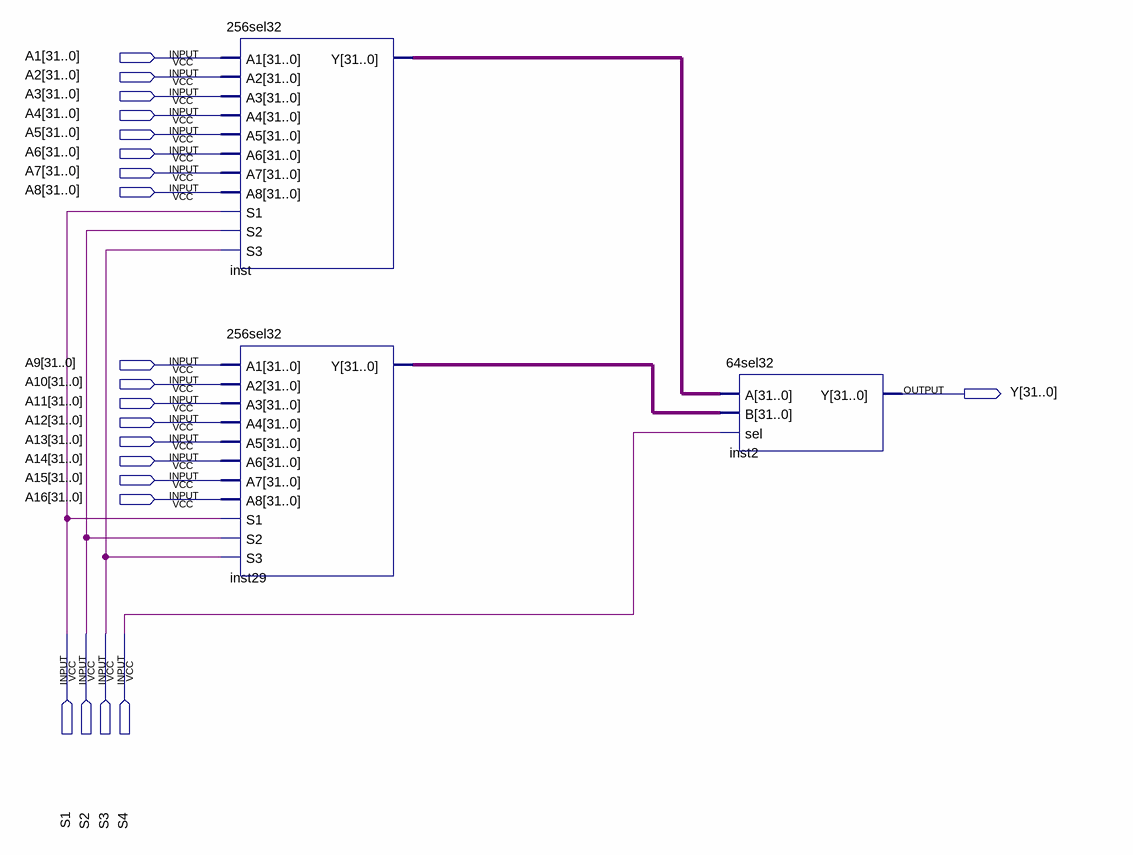
[diagram p0: schematic sheet]
// Quartus schematic 512sel32.bdf as structural Verilog: 3 symbols, 21 pins
module \512sel32  (
  input  [31:0] A1,
  input  [31:0] A2,
  input  [31:0] A3,
  input  [31:0] A4,
  input  [31:0] A5,
  input  [31:0] A6,
  input  [31:0] A7,
  input  [31:0] A8,
  input  [31:0] A9,
  input  [31:0] A10,
  input  [31:0] A11,
  input  [31:0] A12,
  input  [31:0] A13,
  input  [31:0] A14,
  input  [31:0] A15,
  input  [31:0] A16,
  input  S1,
  input  S2,
  input  S3,
  input  S4,
  output [31:0] Y
);

  wire [31:0] inst29_y, inst_y;

  \256sel32  inst (
    .A1(A1), .A2(A2), .A3(A3), .A4(A4), .A5(A5), .A6(A6), .A7(A7), .A8(A8), .S1(S1), .S2(S2), .S3(S3),
    .Y(inst_y));
  \256sel32  inst29 (
    .A1(A9), .A2(A10), .A3(A11), .A4(A12), .A5(A13), .A6(A14), .A7(A15), .A8(A16), .S1(S1), .S2(S2), .S3(S3),
    .Y(inst29_y));
  \64sel32  inst2 (.A(inst_y), .B(inst29_y), .sel(S4), .Y(Y));
endmodule
